# Altium schematic sheet MCU.SchDoc
size A3; SheetNumber: 2; SheetTotal: 8
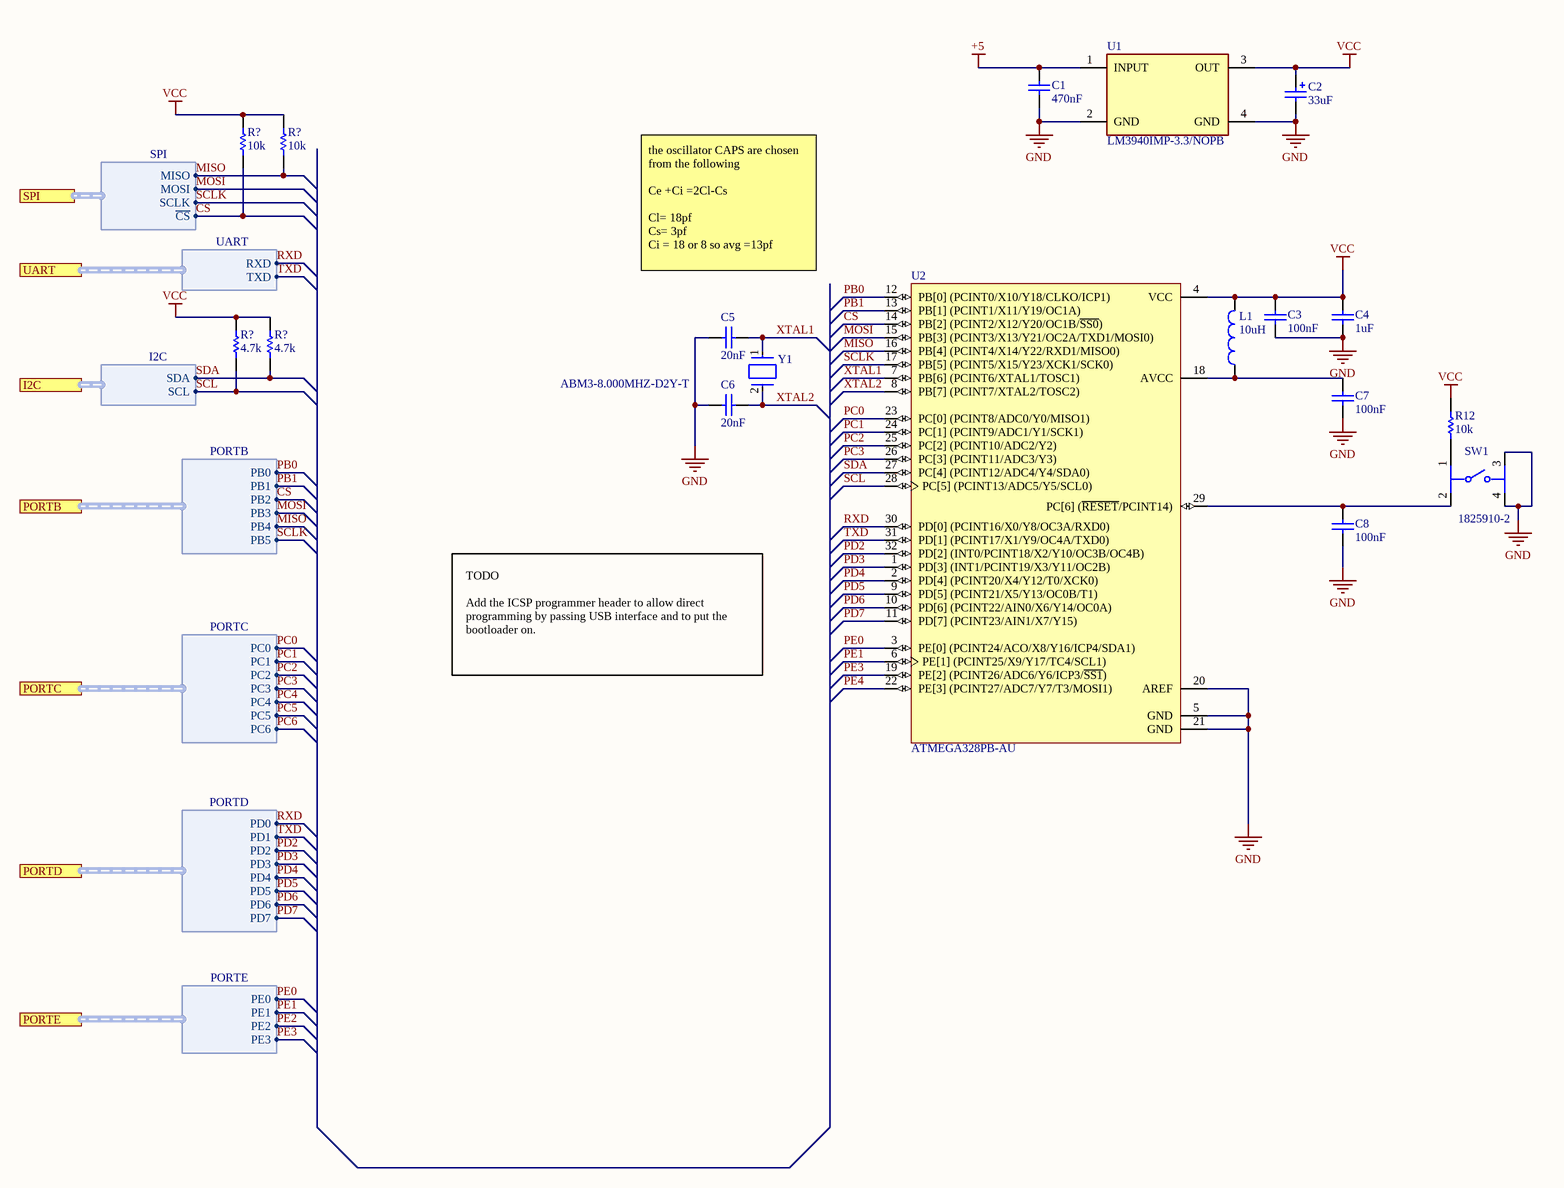
[diagram p0: MCU.SchDoc]

## Parts
(Parts that share a designator on the sheet are numbered #1, #2 ... from top to bottom, then left to right.)
C1  470nF
C2  33uF
C3  100nF
C4  1uF
C5  20nF
C6  20nF
C7  100nF
C8  100nF
L1  10uH  [0402-A]
R12  10k
R?#1  10k
R?#2  10k
R?#3  4.7k
R?#4  4.7k
SW1  1825910-2  [FP-1825910-2-0]
U1  LM3940IMP-3.3/NOPB  [FP-DCY0004A-MFG]
U2  ATMEGA328PB-AU  [ATML-32A_M]
Y1  ABM3-8.000MHZ-D2Y-T  [FP-ABM3-MFG]

## Ports
I2C (harness I2C), PORTB (harness PORTB), PORTC (harness PORTC), PORTD (harness PORTD), PORTE (harness PORTE), SPI (harness SPI), UART (harness UART)

## Harnesses
SPI: MISO, MOSI, SCLK, ~{CS}
UART: RXD, TXD
I2C: SDA, SCL
PORTB: PB0, PB1, PB2, PB3, PB4, PB5
PORTC: PC0, PC1, PC2, PC3, PC4, PC5, PC6
PORTD: PD0, PD1, PD2, PD3, PD4, PD5, PD6, PD7
PORTE: PE0, PE1, PE2, PE3

## Nets
+5: C1.2 U1.1(INPUT)
GND: C1.1 C2.2 C3.1 C4.1 C5.2 C6.2 C7.1 C8.1 SW1.3 SW1.4 U1.2(GND) U1.4(GND) U2.5(GND) U2.20(AREF) U2.21(GND)
VCC: C2.1 C3.2 C4.2 L1.2 R12.2 R?#1.2 R?#2.2 R?#3.2 R?#4.2 U1.3(OUT) U2.4(VCC)
~{CS}: R?#1.1 U2.14(PB[2]_(PCINT2/X12/Y20/OC1B/~{SS0})) ; port SPI.~{CS}
CS: port PORTB.PB2
MISO: R?#2.1 U2.16(PB[4]_(PCINT4/X14/Y22/RXD1/MISO0)) ; port SPI.MISO, port PORTB.PB4
MOSI: U2.15(PB[3]_(PCINT3/X13/Y21/OC2A/TXD1/MOSI0)) ; port SPI.MOSI, port PORTB.PB3
PB0: U2.12(PB[0]_(PCINT0/X10/Y18/CLKO/ICP1)) ; port PORTB.PB0
PB1: U2.13(PB[1]_(PCINT1/X11/Y19/OC1A)) ; port PORTB.PB1
PC0: U2.23(PC[0]_(PCINT8/ADC0/Y0/MISO1)) ; port PORTC.PC0
PC1: U2.24(PC[1]_(PCINT9/ADC1/Y1/SCK1)) ; port PORTC.PC1
PC2: U2.25(PC[2]_(PCINT10/ADC2/Y2)) ; port PORTC.PC2
PC3: U2.26(PC[3]_(PCINT11/ADC3/Y3)) ; port PORTC.PC3
PC4: port PORTC.PC4
PC5: port PORTC.PC5
PC6: port PORTC.PC6
PD2: U2.32(PD[2]_(INT0/PCINT18/X2/Y10/OC3B/OC4B)) ; port PORTD.PD2
PD3: U2.1(PD[3]_(INT1/PCINT19/X3/Y11/OC2B)) ; port PORTD.PD3
PD4: U2.2(PD[4]_(PCINT20/X4/Y12/T0/XCK0)) ; port PORTD.PD4
PD5: U2.9(PD[5]_(PCINT21/X5/Y13/OC0B/T1)) ; port PORTD.PD5
PD6: U2.10(PD[6]_(PCINT22/AIN0/X6/Y14/OC0A)) ; port PORTD.PD6
PD7: U2.11(PD[7]_(PCINT23/AIN1/X7/Y15)) ; port PORTD.PD7
PE0: U2.3(PE[0]_(PCINT24/ACO/X8/Y16/ICP4/SDA1)) ; port PORTE.PE0
PE1: U2.6(PE[1]_(PCINT25/X9/Y17/TC4/SCL1)) ; port PORTE.PE1
PE2: port PORTE.PE2
PE3: U2.19(PE[2]_(PCINT26/ADC6/Y6/ICP3/~{SS1})) ; port PORTE.PE3
PE4: U2.22(PE[3]_(PCINT27/ADC7/Y7/T3/MOSI1))
RXD: U2.30(PD[0]_(PCINT16/X0/Y8/OC3A/RXD0)) ; port UART.RXD, port PORTD.PD0
SCL: R?#3.1 U2.28(PC[5]_(PCINT13/ADC5/Y5/SCL0)) ; port I2C.SCL
SCLK: U2.17(PB[5]_(PCINT5/X15/Y23/XCK1/SCK0)) ; port SPI.SCLK, port PORTB.PB5
SDA: R?#4.1 U2.27(PC[4]_(PCINT12/ADC4/Y4/SDA0)) ; port I2C.SDA
TXD: U2.31(PD[1]_(PCINT17/X1/Y9/OC4A/TXD0)) ; port UART.TXD, port PORTD.PD1
XTAL1: C5.1 U2.7(PB[6]_(PCINT6/XTAL1/TOSC1)) Y1.1
XTAL2: C6.1 U2.8(PB[7]_(PCINT7/XTAL2/TOSC2)) Y1.2
NetC7_2: C7.2 L1.1 U2.18(AVCC)
NetC8_2: C8.2 SW1.2 U2.29(PC[6]_(~{RESET}/PCINT14))
NetR12_1: R12.1 SW1.1

## Notes on the sheet
- the oscillator CAPS are chosen from the following
  Ce +Ci =2Cl-Cs
  Cl= 18pf
  Cs= 3pf
  Ci = 18 or 8 so avg =13pf
- TODO
  Add the ICSP programmer header to allow direct programming by passing USB interface and to put the bootloader on.

## Library data of the parts
C1 = 470nF: Capacitor; Published: 8-Jun-2000; LatestRevisionDate: 17-Jul-2002; LatestRevisionNote: Re-released for DXP Platform.; PackageReference: RAD-0.3; Publisher: Altium Limited; PackageDescription: Radial Cap, Thru-Hole; 2 Leads; 0.3 in Pin Spacing
C2 = 33uF: Polarized Capacitor; Published: 8-Jun-2000; LatestRevisionDate: 29-May-2009; LatestRevisionNote: IPC-7351 Footprint Added.; PackageReference: C0805; Publisher: Altium Limited; PackageDescription: Chip Capacitor
C3 C7 C8 = 100nF: Capacitor; Published: 8-Jun-2000; LatestRevisionDate: 17-Jul-2002; LatestRevisionNote: Re-released for DXP Platform.; PackageReference: RAD-0.3; Publisher: Altium Limited; PackageDescription: Radial Cap, Thru-Hole; 2 Leads; 0.3 in Pin Spacing
C4 = 1uF: Capacitor; Published: 8-Jun-2000; LatestRevisionDate: 17-Jul-2002; LatestRevisionNote: Re-released for DXP Platform.; PackageReference: RAD-0.3; Publisher: Altium Limited; PackageDescription: Radial Cap, Thru-Hole; 2 Leads; 0.3 in Pin Spacing
C5 C6 = 20nF: Capacitor; Published: 8-Jun-2000; LatestRevisionDate: 17-Jul-2002; LatestRevisionNote: Re-released for DXP Platform.; PackageReference: RAD-0.3; Publisher: Altium Limited; PackageDescription: Radial Cap, Thru-Hole; 2 Leads; 0.3 in Pin Spacing
L1 = 10uH: Inductor; Code_IEC: 1005; Published: 8-Jun-2000; LatestRevisionDate: 29-May-2009; LatestRevisionNote: IPC-7351 Footprint Added.; PackageReference: 0402-A; Publisher: Altium Limited; PackageDescription: Chip Inductor; Code_JEITA: 0402
R12 R?#1 R?#2 = 10k: Resistor; Published: 8-Jun-2000; LatestRevisionDate: 17-Jul-2002; LatestRevisionNote: Re-released for DXP Platform.; PackageReference: AXIAL-0.3; Publisher: Altium Limited; PackageDescription: Axial Device, Thru-Hole; 2 Leads; 0.3 in Pin Spacing
R?#3 R?#4 = 4.7k: 4.7k Resistor; Published: 8-Jun-2000; LatestRevisionDate: 17-Jul-2002; LatestRevisionNote: Re-released for DXP Platform.; PackageReference: AXIAL-0.3; Publisher: Altium Limited; PackageDescription: Axial Device, Thru-Hole; 2 Leads; 0.3 in Pin Spacing
SW1 = CMP-03407-000004-1: SWITCH TACTILE SPST-NO 0.05A 24V; Manufacturer: TE; Contact Current Rating: 50mA; Operating Force: 160gf; Contact Resistance: 100mΩ; Electromechanical Life: 100000Cycles; Package: 0; ComponentLink2Description: Datasheet; Digikey Description: SWITCH TACTILE SPST-NO 0.05A 24V; Octopart: https://octopart.com/1825910-2-te+connectivity-42270502; Temperature Range Low: -35°C; Temperature Range High: +85°C; Lead Free: Yes; Device Class L2: Switches; Automotive: No; Temperature: -35°C to +85°C; Device Class L1: Electromechanical; Category: Switch; ComponentLink2URL: https://www.te.com/commerce/DocumentDelivery/DDEController?Action=showdoc&DocId=Customer+Drawing%7F1825910%7FC10%7Fpdf%7FEnglish%7FENG_CD_1825910_C10.pdf%7F1825910-2; Mount: Through Hole; RoHS: TRUE; Height: 4.6mm; Manufacturer Part Number: 1825910-2; Device Class L3: Tactile Switches; Voltage Rating Dc: 24V; Throw Configuration: SPST-NO
U1 = CMP-0062-01788-4: IC REG LINEAR 3.3V 1A SOT223-4; Min Input Voltage: 4.5V; Max Supply Voltage: 7.5V; Number of Outputs: 1; Output Type: Fixed; Polarity: Positive; Dropout Voltage: 500mV; Quiescent Current: 15mA; Max Output Voltage: 3.3V; Length: 6.5mm; Termination: SMD/SMT; Width: 3.56mm; Min Supply Voltage: 4.5V; Max Output Current: 1A; Case/Package: SOT-223; Output Voltage: 3.3V; Current Rating: 1A; Packaging: Tape and Reel; Lead Free: Lead Free; Nominal Output Voltage: 3.3V; Height: 1.6mm; Series: -; Output Configuration: Positive; Radiation Hardening: No; Number of Regulators: 1; Package Quantity: 1000; REACH SVHC: No SVHC; Max Input Voltage: 7.5V; Max Operating Temperature: 125°C; Min Operating Temperature: -40°C; Output Current: 1A; Contact Plating: Tin; Number of Pins: 4; Mount: Surface Mount
U2 = CMP-2000-07439-1: AVR Microcontroller, 1.8 to 5.5 V, 32 KB Flash, 1 KB EEPROM, 2 KB SRAM, -40 to 85 degC, 32-Pin TQFP (32A), RoHS, Tray; Manufacturer: Microchip; Datasheet URL: http://ww1.microchip.com/downloads/en/DeviceDoc/40001906A.pdf; Mounting Technology: SurfaceMount; RoHSCompliant: false; Manufacturer URL: http://www.microchip.com/; Package Description: 32-Pin Thin Profile Plastic Quad Flat Package, Body 7 x 7 mm, Pitch 0.8 mm; Package Reference: 32A; Datasheet Version: Rev. A, 04/2017
Y1 = CMP-2000-05033-2: Crystal 8MHz ±20ppm 18pF SMD-2 5mm x 3.2mm; Series Resistance: 500R; Frequency Stability: 30ppm; ESR (Equivalent Series Resistance): 140R; Load Capacitance: 18pF; Height: 0.051inch; Tolerance: 20ppm; Depth: 3.2mm; Max Operating Temperature: 85°C; Frequency: 8MHz; Termination: SMD/SMT; Lead Free: Lead Free; Number of Pins: 2; Width: 3.2mm; RoHS Compliant: Yes; Resistor Type: Ceramic; Length: 5mm; Mount: Surface Mount; Case/Package: CSMD; Package Quantity: 1000; Radiation Hardening: No; Min Operating Temperature: -40°C; Packaging: Tape and Reel; Frequency Tolerance: 20ppm